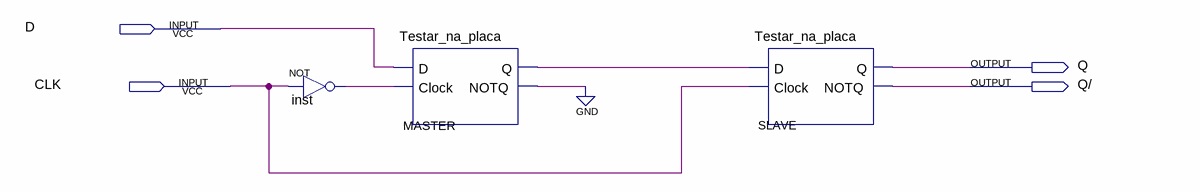
[diagram p0: schematic sheet]
// Quartus schematic Block2.bdf as structural Verilog: 3 symbols, 4 pins
module Block2 (
  input  D,
  input  CLK,
  output Q,
  output \Q/ 
);

  wire inst_out, MASTER_notq, MASTER_q;

  not inst (inst_out, CLK);
  Testar_na_placa MASTER (.D(D), .Clock(inst_out), .Q(MASTER_q), .NOTQ(MASTER_notq));
  Testar_na_placa SLAVE (.D(MASTER_q), .Clock(CLK), .Q(Q), .NOTQ(\Q/ ));
  // also tied to GND on the sheet: MASTER_notq
endmodule
